# Altium schematic sheet M10-4-20mA.SchDoc
size A4; ApprovedBy: -; CheckedBy: h.t.t.monfared; Author: h.t.t.monfared; Engineer: h.t.t.monfared; Revision: 1.0; SheetNumber: 10; SheetTotal: 10; Project Code:: UFM Sensor Controller; Document Title:: 4-20 mA transmitter Sheet
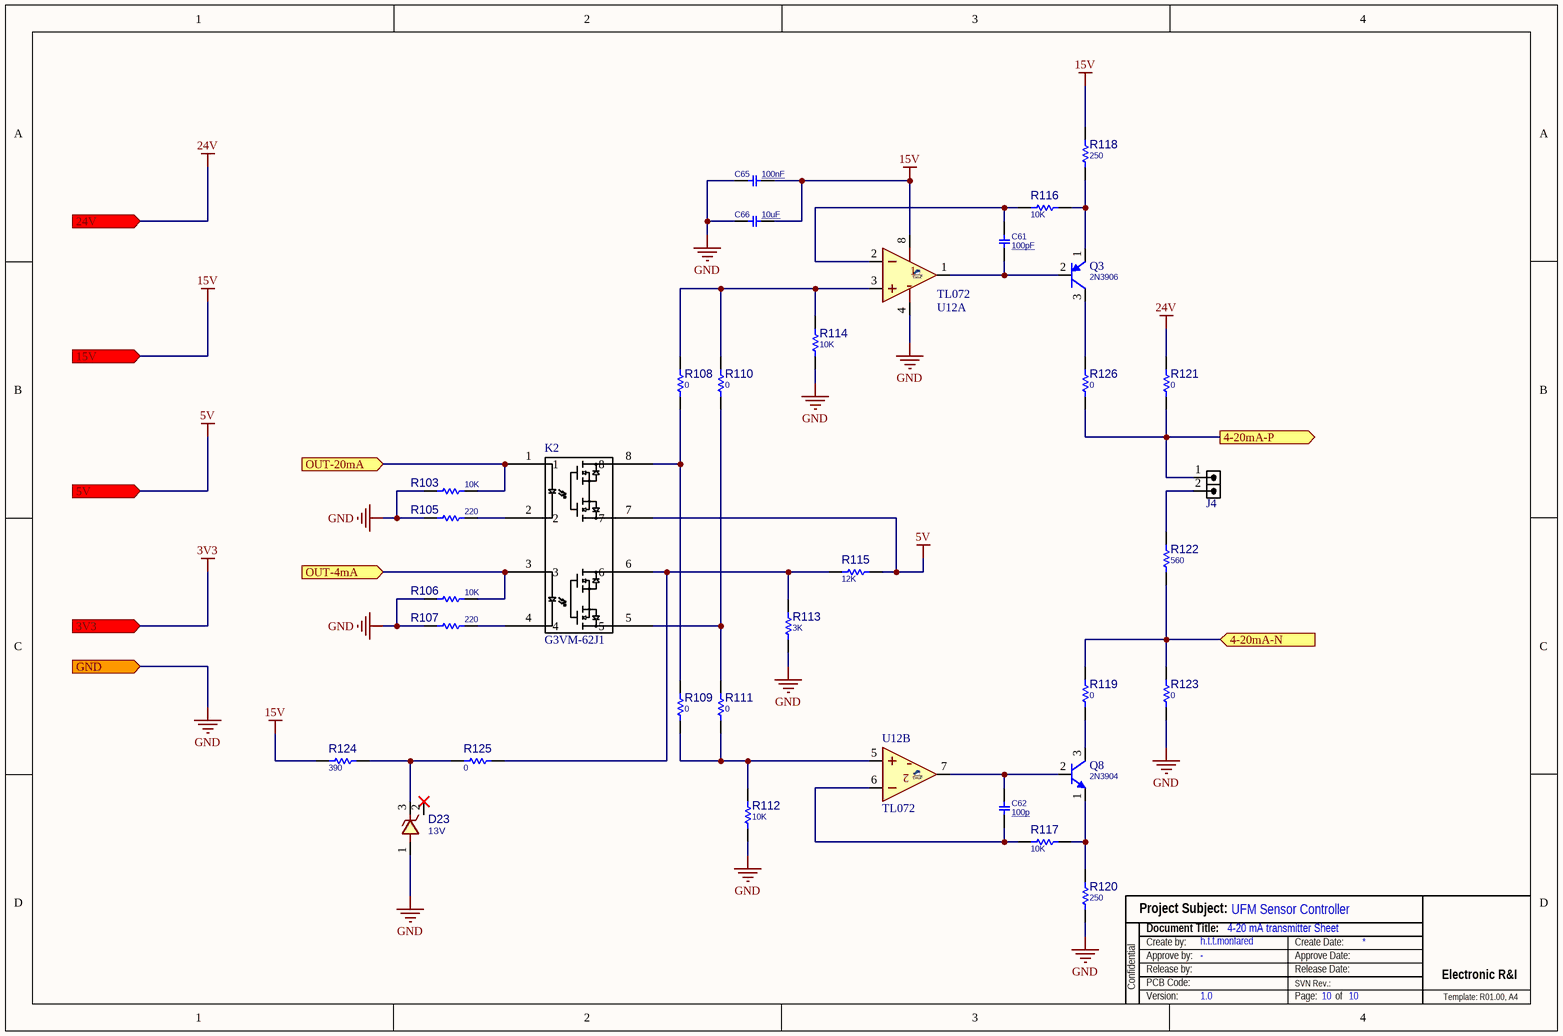
[diagram p0: M10-4-20mA.SchDoc]

## Parts
C61  100pF  [C1206]
C62  100p  [C1206]
C65  100nF  [C1206]
C66  10uF  [C1206]
D23  13V  [SOT23_3]
J4  HDRM2  [HDR_M_1X2]  (value not drawn)
K2  G3VM-62J1  [J-SOP8_OMR]
Q3  2N3906  [TO92_3]
Q8  2N3904  [TO92_3]
R103  10K  [R1206]
R105  220  [R1206]
R106  10K  [R1206]
R107  220  [R1206]
R108  0  [R1206]
R109  0  [R1206]
R110  0  [R1206]
R111  0  [R1206]
R112  10K  [R1206]
R113  3K  [R1206]
R114  10K  [R1206]
R115  12K  [R1206]
R116  10K  [R1206]
R117  10K  [R1206]
R118  250  [R1206]
R119  0  [R1206]
R120  250  [R1206]
R121  0  [R1206]
R122  560  [R1210]
R123  0  [R1206]
R124  390  [R1206]
R125  0  [R1206]
R126  0  [R1206]
U12  TL072  [SO_8]  (parts A,B of 2)

## Ports
3V3 (in), 4-20mA-N (in), 4-20mA-P (out), 5V (in), 15V (in), 24V (in), GND (in), OUT-4mA (in), OUT-20mA (in)

## Nets
3V3: port 3V3
5V: K2.7 R115.1 ; port 5V
15V: C65.2 C66.2 R118.2 R124.1 U12.8(V+) ; port 15V
24V: R121.2 ; port 24V
GND: C65.1 C66.1 D23.1 R103.2 R105.1 R106.2 R107.1 R112.1 R113.2 R114.1 R120.1 R123.1 U12.4(V-) ; port GND
4-20mA-N: R119.2 R122.1 R123.2 ; port 4-20mA-N
4-20mA-P: J4.1 R121.1 R126.1 ; port 4-20mA-P
OUT-4mA: K2.3 R106.1 ; port OUT-4mA
OUT-20mA: K2.1 R103.1 ; port OUT-20mA
NetC61_1: C61.1 Q3.2(B) U12.1(OUT1)
NetC61_2: C61.2 R116.1 U12.2(IN1-)
NetC62_1: C62.1 R117.2 U12.6(IN2-)
NetC62_2: C62.2 Q8.2(B) U12.7(OUT2)
NetD23_3: D23.3 R124.2 R125.1
NetJ4_2: J4.2 R122.2
NetK2_2: K2.2 R105.2
NetK2_4: K2.4 R107.2
NetK2_5: K2.5 R110.1 R111.2
NetK2_6: K2.6 R113.1 R115.2 R125.2
NetK2_8: K2.8 R108.1 R109.2
NetQ3_1: Q3.1(E) R116.2 R118.1
NetQ3_3: Q3.3(C) R126.2
NetQ8_1: Q8.1(E) R117.1 R120.2
NetQ8_3: Q8.3(C) R119.1
NetR108_2: R108.2 R110.2 R114.2 U12.3(IN2+)
NetR109_1: R109.1 R111.1 R112.2 U12.5(IN2+)

Not connected (* = marked no-connect by the designer): D23 2*

## Notes on the sheet
- Project Subject:
- Confidential
- Release by:
- Document Title:
- Create by:
- PCB Code:
- Approve by:
- SVN Rev.:
- Create Date:
- Release Date:
- Approve Date:
- Electronic R&I
- Version:
- Page:
- of
- Template: R01.00, A4

## Library data of the parts
C61 C62 C65 C66 = CAP_SMD_MLCC: CAP, MLCC, 1nF, 50V, C0G, 10%, 0402; MANF_P#: MANF_PART#; MANF: Murata; PARAM: C0G, 10%; PRICE: 100= 1$; DESC: CAP, MLCC, 1nF, 50V, C0G, 10%, 0402; PARAM2: 50V; ASSEMBLY: ASSEMBLY
  C61: VALUE: 100pF
  C62: VALUE: 100p
  C65: VALUE: 100nF
  C66: VALUE: 10uF
D23 = DIODE_SMD_ZENER_BZX84-C12: DIODE, ZENER, 0.25W, 12.7V; MANF: NXP; DESC: DESCRIPTION; PARAM2: 12.7V, 0.9VF; PARAM: 0.25W, 10mA IF; ASSEMBLY: ASSEMBLY; PRICE: PRICE; MANF_P#: BZX84-C12; VALUE: 13V
J4 = HDR_M_1X2: CONN, HEADER, Male, pitch: 2.54mm, 2POS; VALUE: HDRM2
K2 = G3VM-62J1: No Description Available; Mfr_Name: Omron; RefDes: RefDes; Type: Type
Q3 = PNP_2N3906_TO92: BJT, PNP, 40v, 0.6A, THD, TO92; PARAM: 40v, 0.2A; PARAM2: 625mW; MANF: ST; MANF_P#: 2N3906; VALUE: 2N3906
Q8 = NPN_2N3904_TO92: BJT, NPN, 40v, 0.6A, THD, TO92; PARAM: 40v, 0.2A; PARAM2: 625mW; MANF: ST; MANF_P#: 2N3904; VALUE: 2N3904
R103 R105-R126 = RES_SMD: RESISTOR, SMD; PARAM: -W; DESC: DESCRIPTION; DIST#: MOUSER; PARAM2: 1%; MANF_P#: -; MANF: -; ASSEMBLY: ASSEMBLY; PRICE: 100= 0.5$
  R103 R106 R112 R114 R116 R117: VALUE: 10K
  R105 R107: VALUE: 220
  R108-R111 R119 R121 R123 R125 R126: VALUE: 0
  R113: VALUE: 3K
  R115: VALUE: 12K
  R118 R120: VALUE: 250
  R122: VALUE: 560
  R124: VALUE: 390
U12 = TL072_SOP8: AMP, Dual, Lo-Noise, JFET Input; MANF: Texas Instruments; MANF_P#: TL072CDR, TL072IDR; VALUE: TL072